# Altium schematic sheet Top Sheet.SchDoc
size Letter; Address4: USA
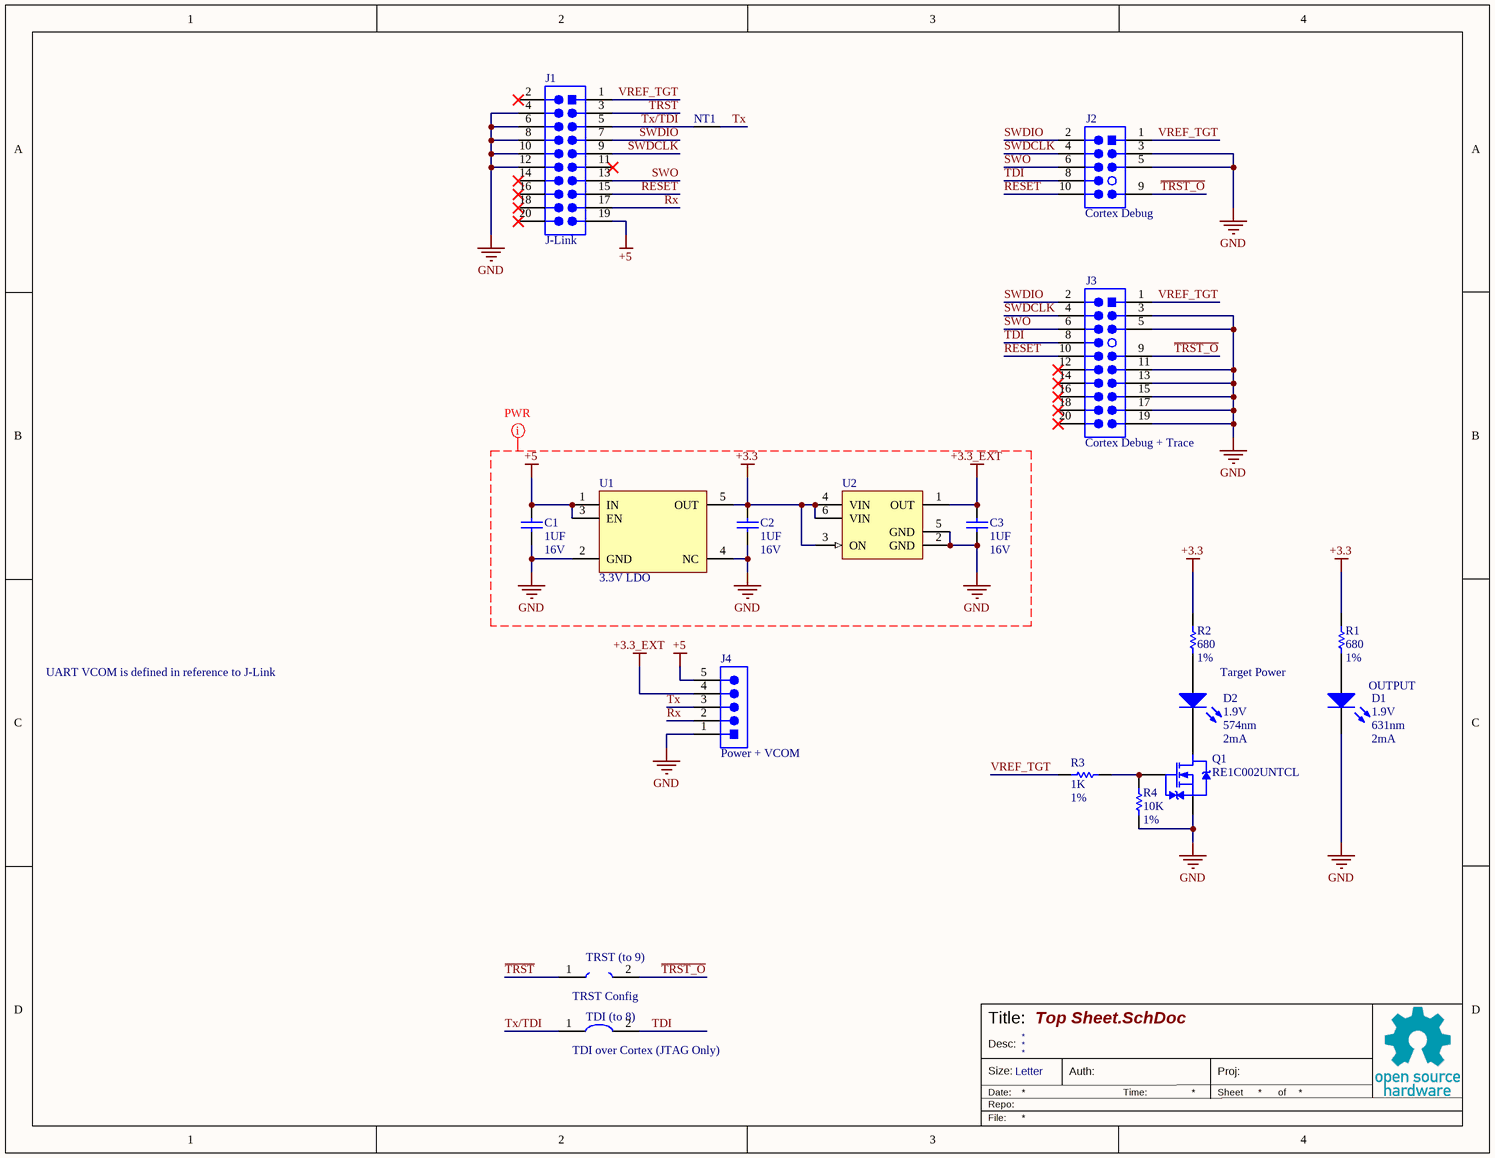
[diagram p0: Top Sheet.SchDoc]

## Parts
C1  Val: 1UF  Vol: 16V  [0603_CAP]  (hidden comment: CAP 0603 1UF 16V 10% X7R)
C2  Val: 1UF  Vol: 16V  [0603_CAP]  (hidden comment: CAP 0603 1UF 16V 10% X7R)
C3  Val: 1UF  Vol: 16V  [0603_CAP]  (hidden comment: CAP 0603 1UF 16V 10% X7R)
D1  Voltage Rating: 1.9V  Wavelength: 631nm  Test Current: 2mA  [SM0805HCL]  (hidden comment: Red LED)
D2  Voltage Rating: 1.9V  Wavelength: 574nm  Test Current: 2mA  [SM0805GCL]  (hidden comment: Green LED)
J1  20 contact Female header, RA  [SFH11-PBPC-D10-RA-BK]  (value not drawn)
J2  Cortex Debug, 0.050" 10 Pin  [FTSH-105-01-F-DV-007-K PLUGOUT]  (value not drawn)
J3  Cortex Debug+ETM Connector, 0.050" 20 Pin  [FTSH-110-01-F-DV-007-K plugout]  (value not drawn)
J4  5 Pin, 2mm  [B5B-PH-K-S with wires]  (value not drawn)
NT1  Net Tie  [NT10]  (value not drawn)  (net tie, no BOM)
Q1  Manufacturer P/N: RE1C002UNTCL  [SC89]  (hidden comment: N-Channel MOSFET)
R1  Val: 680  Tol: 1%  [0603_RES]  (hidden comment: RES 0603 680 1%)
R2  Val: 680  Tol: 1%  [0603_RES]  (hidden comment: RES 0603 680 1%)
R3  Val: 1K  Tol: 1%  [0603_RES]  (hidden comment: RES 0603 1K 1%)
R4  Val: 10K  Tol: 1%  [0603_RES]  (hidden comment: RES 0603 10K 1%)
TDI_(to_8)  SMD JMP  [SMD_JMP_SHRT]  (value not drawn)  (net tie, no BOM)
TRST_(to_9)  SMD JMP  [SMD_JMP_OPEN]  (value not drawn)  (no BOM)
U1  3.3V LDO  [SOT23-5]
U2  Hot Swap Controller  [TI_DBV0006A]  (value not drawn)

## Nets
+3.3: C2.2 R1.2 R2.2 U1.5(OUT) U2.3(ON) U2.4(VIN) U2.6(VIN)
+3.3_EXT: C3.2 J4.4 U2.1(OUT)
+5: C1.2 J1.19 J4.5 U1.1(IN) U1.3(EN)
GND: C1.1 C2.1 C3.1 D1.K J1.4 J1.6 J1.8 J1.10 J1.12 J2.3(GND) J2.5(GND) J3.3(GND) J3.5(GND) J3.11(GND/TgtPwr+Cap) J3.13 J3.15(GND) J3.17(GND) J3.19(GND) J4.1 Q1.2(S) R4.1 U1.2(GND) U1.4(NC) U2.2(GND) U2.5(GND)
~{RESET}: J1.15 J2.10(~{RESET}) J3.10(~{RESET})
~{TRST}: J1.3 TRST_(to_9).1
~{TRST_O}: J2.9(GNDDetect) J3.9(GNDDetect) TRST_(to_9).2
Rx: J1.17 J4.2
SWDCLK: J1.9 J2.4(SWDCLK/TCK) J3.4(SWDCLK/TCK)
SWDIO: J1.7 J2.2(SWDIO/TMS) J3.2(SWDIO/TMS)
SWO: J1.13 J2.6(SWO/TDO) J3.6(SWO/TDO/EXTa/TRACECTL)
TDI: J2.8(NC/TDI) J3.8(NC/EXTb/TDI) TDI_(to_8).2
Tx: J4.3 NT1.2
Tx/TDI: J1.5 NT1.1 TDI_(to_8).1
VREF_TGT: J1.1 J2.1(VCC) J3.1(VCC) R3.1
NetD1_A: D1.A R1.1
NetD2_A: D2.A R2.1
NetD2_K: D2.K Q1.3(D)
NetQ1_1: Q1.1(G) R3.2 R4.2

Not connected (* = marked no-connect by the designer): J1 2* 11* 14* 16* 18* 20*; J3 12(TRACECLK)* 14(TRACEDATA[0])* 16(TRACEDATA[1])* 18(TRACEDATA[2])* 20(TRACEDATA[3])*

## Layout directives
net class PWR: +3.3, +3.3_EXT, +5, GND

## Notes on the sheet
- (near J2) Cortex Debug
- (near J1) J-Link
- (near J3) Cortex Debug + Trace
- UART VCOM is defined in reference to J-Link
- Target Power
- OUTPUT
- (near J4) Power + VCOM
- (near TRST_(to_9)) TRST Config
- (near TDI_(to_8)) TDI over Cortex (JTAG Only)
- Title:
- Desc:
- Size:
- Date:
- File:
- Repo:
- Letter
- Auth:
- Time:
- Sheet
- Proj:
- of

## Library data of the parts
C1-C3 = CAP 0603 1UF 16V 10% X7R: Capacitor Surface Mount 0603 Footprint 1UF 16V 10% Tolerance Ceramic X7R; Manufacturer: Various; PCB Package: 0603; Description in Visual: Cap SMT 0603 1UF 16V 10% Ceramic X7R; P/N: CAP 0603 1UF 16V 10% X7R; Manufacturer P/N: Various; Value: 1UF; Voltage: 16V; Tolerance: 10%; Type: Ceramic X7R; ComponentLink1Description: Manufacturer Website; ComponentLink2Description: Component Datasheet; ComponentLink3Description: Octopart Link; Supplier 1: Digi-Key; Supplier Part Number 1: 1276-1943-1-ND; Supplier 2: Digi-Key; Supplier Part Number 2: 311-1446-1-ND; Supplier 3: Digi-Key; Supplier Part Number 3: 587-3305-1-ND; Supplier 4: Digi-Key; Supplier Part Number 4: 399-7847-1-ND
D1 = SM0805HCL: Red 631nm LED Indication - Discrete 1.9V 0805 (2012 Metric); Manufacturer: Bivar; PCB Package: 0805; Configuration: Single; Lens Style: Square; Millicandela Rating: 11.5mcd; Viewing Angle: 130°; Lens Type: Clear; Package Class: Surface Mount; P/N: SM0805HCL; Manufacturer P/N: SM0805HCL; Description in Visual: Red 631nm LED Indication - Discrete 1.9V 0805 (2012 Metric); Color: Red; ComponentLink1Description: Manufacturer Website; ComponentLink1URL: #https://www.bivar.com/#; ComponentLink2Description: Component Datasheet; ComponentLink2URL: https://www.bivar.com/parts_content/Datasheets/SM0805HCL.pdf; ComponentLink3Description: Octopart Link; ComponentLink3URL: #https://octopart.com/sm0805hcl-bivar-2191581?r=sp#
D2 = SM0805GCL: Green 574nm LED Indication - Discrete 1.9V 0805 (2012 Metric); Manufacturer: Bivar; PCB Package: 0805; Configuration: Single; Lens Style: Square; Millicandela Rating: 3.6mcd; Viewing Angle: 130°; Lens Type: Clear; Package Class: Surface Mount; P/N: SM0805GCL; Manufacturer P/N: SM0805GCL; Description in Visual: Green 574nm LED Indication - Discrete 1.9V 0805 (2012 Metric); Color: Green; ComponentLink1Description: Manufacturer Website; ComponentLink1URL: #https://www.bivar.com/#; ComponentLink2Description: Component Datasheet; ComponentLink2URL: https://www.bivar.com/parts_content/Datasheets/SM0805HCL.pdf; ComponentLink3Description: Octopart Link; ComponentLink3URL: #https://octopart.com/sm0805gcl-bivar-22059573?r=sp#
J1 = SFH11-PBPC-D10-RA-BK: 20 Position Header Connector  Through Hole, Right Angle; Manufacturer: Sullins; PCB Package: 2x10 THT; Description in Visual: Con Hdr Female 20 contacts horizontal 2X10 keyed; Number of Contacts: 20; Pitch: 0.100"; P/N: SFH11-PBPC-D10-RA-BK; Manufacturer P/N: SFH11-PBPC-D10-RA-BK; Orientation: horizontal; Number of Rows: 2; ComponentLink1Description: Manufacturer Website; ComponentLink1URL: https://www.sullinscorp.com/; ComponentLink2Description: Component Datasheet; ComponentLink2URL: https://datasheet.ciiva.com/754/sfh11-pxxc-dxx-ra-xx11161-c-754566.pdf?src-supplier=Digi-Key; Supplier 1: Digi-Key; Supplier Part Number 1: S9205-ND
J2 = ARM Cortex Debug: 10 Pin Shrouded Header, 0.050", Key Pin 7; Manufacturer: Samtech; Manufacturer P/N: Various; Number of Contacts: 10; Gender: Male; P/N: ARM Cortex Debug; Description in Visual: 10 Pin Shrouded Header, 0.050", Key Pin 7; Orientation: Vertical; Number of Rows: 2; Pitch: 0.050"; Contact Finish: Gold; ComponentLink1Description: Pinout Reference; ComponentLink1URL: http://infocenter.arm.com/help/topic/com.arm.doc.faqs/attached/13634/cortex_debug_connectors.pdf; Supplier 3: Digi-Key; Supplier Part Number 3: SAM11250-ND; Supplier 1: Digi-Key; Supplier Part Number 1: SAM15640-ND; Supplier 2: Digi-Key; Supplier Part Number 2: SAM13926CT-ND
J3 = Cortex Debug+ETM: 20 Pin Shrouded Header, 0.050", Key Pin 7; Manufacturer: Samtech; Manufacturer P/N: Various; Number of Contacts: 20; Gender: Male; P/N: Cortex Debug+ETM; Description in Visual: 20 Pin Shrouded Header, 0.050", Key Pin 7; Orientation: Vertical; Number of Rows: 2; Pitch: 0.050"; Contact Finish: Gold; ComponentLink1Description: Pinout Reference; ComponentLink1URL: http://infocenter.arm.com/help/topic/com.arm.doc.faqs/attached/13634/cortex_debug_connectors.pdf; Supplier 3: Digi-Key; Supplier Part Number 3: SAM11264-ND; Supplier 4: Avnet; Supplier Part Number 4: FTSH-110-01-F-DV-007-K-A; Supplier 1: Digi-Key; Supplier Part Number 1: SAM15422CT-ND; Supplier 2: Avnet; Supplier Part Number 2: FTSH-110-01-F-DV-007-K-TR
J4 = B5B-PH-K-S: JST 5-Pin PH Series, THT (2MM, 5 Pos); Manufacturer: J.S.T. Mfg. Co.,Ltd; Manufacturer P/N: B5B-PH-K-S(LF)(SN); Number of Contacts: 5; P/N: B5B-PH-K-S; PCB Package: B5B-PH-K; Description in Visual: JST 5-Pin PH Series, THT (2MM, 5 Pos); Type: PH; Orientation: Vertical; Mount: THT; ComponentLink1Description: Manufacturer Website; ComponentLink1URL: http://www.jst-mfg.com/index_e.php; ComponentLink2Description: Component Datasheet; ComponentLink2URL: http://www.jst-mfg.com/product/pdf/eng/eXH.pdf; Supplier 1: Arrow; Supplier Part Number 1: B5B-PH-K-S (LF)(SN)
NT1 = Net Tie: Generic Net Tie; P/N: Net Tie
Q1 = RE1C002UNTCL: N-Channel 20V 200mA (Ta) 150mW (Ta) Surface Mount EMT3F (SOT-416FL); Manufacturer: Rohm Semiconductor; Vdss (V): 20; RDSon (mOhms): 800; ID (Amps): 200; Rth(JC) (K/W): 833; P/N: RE1C002UNTCL; PCB Package: EMT3F; Description in Visual: N-Channel 20V 200mA (Ta) 150mW (Ta) Surface Mount EMT3F (SOT-416FL); Package Class: Surface Mount; ComponentLink1Description: Manufacturer Website; ComponentLink1URL: #http://www.rohm.com#; ComponentLink2Description: Component Datasheet; ComponentLink2URL: https://d1d2qsbl8m0m72.cloudfront.net/en/products/databook/datasheet/discrete/transistor/mosfet/re1c002untcl-e.pdf; ComponentLink4Description: SPICE Model; ComponentLink4URL: http://rohmfs.rohm.com/en/products/library/spice/discrete/transistor/mosfet/re1c002un.lib; ComponentLink3Description: Octopart Link; ComponentLink3URL: #https://octopart.com/re1c002untcl-rohm-30008399?r=sp#
R1 R2 = RES 0603 680 1%: Resistor Surface Mount, 680 Ohms, 0603 Footprint, 1% Tolerance 0.1W; Manufacturer: Various; PCB Package: 0603; Description in Visual: Res SMT 680 0603  1%  0.1W; Value: 680; P/N: RES 0603 680 1%; Manufacturer P/N: Various; Power_Rating: 0.1W; Tolerance: 1%; Supplier 1: Digi-Key; Supplier Part Number 1: 541-680HCT-ND; Supplier 2: Digi-Key; Supplier Part Number 2: 2019-RK73H1JTTD6800FCT-ND; Supplier 3: Digi-Key; Supplier Part Number 3: P680HCT-ND; Supplier 4: Digi-Key; Supplier Part Number 4: YAG3356CT-ND
R3 = RES 0603 1K 1%: Resistor Surface Mount, 1K Ohms, 0603 Footprint, 1% Tolerance 0.1W; Manufacturer: Various; PCB Package: 0603; Description in Visual: Res SMT 1K 0603  1%  0.1W; P/N: RES 0603 1K 1%; Manufacturer P/N: Various; Value: 1K; Power_Rating: 0.1W; Tolerance: 1%; Supplier 1: Digi-Key; Supplier Part Number 1: 2019-RK73H1JTTD1001FCT-ND; Supplier 2: Digi-Key; Supplier Part Number 2: 541-1166-1-ND; Supplier 3: RSComponents; Supplier Part Number 3: 1051155; Supplier 4: Digi-Key; Supplier Part Number 4: 311-1.00KHRCT-ND
R4 = RES 0603 10K 1%: Resistor Surface Mount, 10K Ohms, 0603 Footprint, 1% Tolerance 0.1W; Manufacturer: Various; PCB Package: 0603; Description in Visual: Res SMT 10K 0603  1%  0.1W; P/N: RES 0603 10K 1%; Manufacturer P/N: Various; Value: 10K; Power_Rating: 0.1W; Tolerance: 1%; Supplier 1: Digi-Key; Supplier Part Number 1: P10.0KHCT-ND; Supplier 2: Digi-Key; Supplier Part Number 2: 541-10.0KHCT-ND; Supplier 3: Newark; Supplier Part Number 3: 68R0128; Supplier 4: Digi-Key; Supplier Part Number 4: A106048CT-ND
TDI_(to_8) = Solder Jumper, Shorted: SMD Jumper, Shorted; P/N: Solder Jumper, Shorted; Manufacturer: N/A; Manufacturer P/N: N/A; Description in Visual: SMD Jumper, Shorted
TRST_(to_9) = Solder Jumper, Open: SMD Jumper, Open; P/N: Solder Jumper, Open; Manufacturer: N/A; Manufacturer P/N: N/A; Description in Visual: SMD Jumper, Open
U1 = TLV75533PDBVR: Linear Voltage Regulator IC  1 Output  500mA SOT-23-5; Manufacturer: Texas Insturments; Vin Min (Volts): 4.7; Vin Max (Volts): 5.5; Quiescent Current (mA): 0.025; P/N: TLV75533PDBVR; Manufacturer P/N: TLV75533PDBVR; Description in Visual: Linear Voltage Regulator IC  1 Output  500mA SOT-23-5; Type: LDO; Output Current: 500mA; Output Voltage (Volts): 3.3V; Temperature Range: -40 to +125 °C; PCB Package: SOT23-5; ComponentLink1Description: Manufacturer's Website; ComponentLink1URL: http://www.ti.com; ComponentLink2Description: Component Datasheet; ComponentLink2URL: https://www.ti.com/lit/ds/symlink/tlv755p.pdf?ts=1590202420722; ComponentLink3Description: Octopart Link; ComponentLink3URL: #https://octopart.com/tlv75533pdbvr-texas+instruments-91272349?r=sp#; Supplier 1: Digi-Key; Supplier Part Number 1: 296-50411-1-ND
U2 = TPS22929D: Power Switch/Driver 1:1 P-Channel 1.8A SOT-23-6; Manufacturer: Texas Instruments; Manufacturer P/N: TPS22929DDBV; PCB Package: SOT23-6; VCC Range: 1.4V to 5.5V; Temp Range: -40°C to 85°C; P/N: TPS22929D; Description in Visual: Power Switch/Driver 1:1 P-Channel 1.8A SOT-23-6; ComponentLink1Description: Manufacturer Website; ComponentLink1URL: http://www.ti.com; ComponentLink2Description: Component Datasheet; ComponentLink2URL: http://www.ti.com/lit/ds/symlink/tps22929d.pdf?HQS=TI-null-null-digikeymode-df-pf-null-wwe&ts=1590442090849; ComponentLink3Description: Octopart Link; ComponentLink3URL: https://octopart.com/tps22929ddbvr-texas+instruments-18531971?r=sp; Supplier Part Number 1: 296-30174-1-ND; Supplier 2: Digi-Key; Supplier Part Number 2: 296-38579-1-ND; Supplier 1: Digi-Key